# Altium schematic sheet XBeeModule.SchDoc: XBEE Radio
size A4; Revision: AA; SheetNumber: 6; SheetTotal: 6
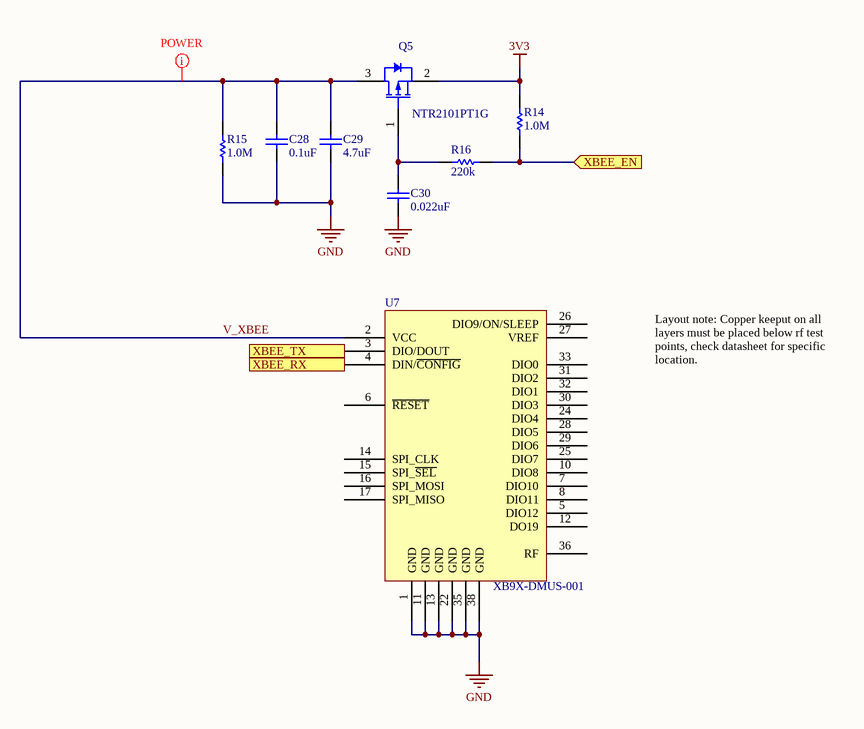
[diagram p0: XBeeModule.SchDoc]

## Parts
C28  value 0.1uF  [0402cap]  (hidden comment: C0402)
C29  value 4.7uF  [0603CAP]  (hidden comment: C0603)
C30  value 0.022uF  [0402cap]  (hidden comment: C0402)
Q5  NTR2101PT1G  [ONSC-SOT-23-3-318-08_V]
R14  value 1.0M  [0402RES]  (hidden comment: R0402)
R15  value 1.0M  [0402RES]  (hidden comment: R0402)
R16  value 220k  [0402RES]  (hidden comment: R0402)
U7  XB9X-DMUS-001  [XBee/XBee-PRO]

## Ports
XBEE_EN (in), XBEE_RX, XBEE_TX

## Nets
3V3: Q5.2(S) R14.2
GND: C28.1 C29.1 C30.1 R15.1 U7.1(GND) U7.11(GND) U7.13(GND) U7.22(GND) U7.35(GND) U7.38(GND)
V_XBEE: C28.2 C29.2 Q5.3(D) R15.2 U7.2(VCC)
XBEE_EN: R14.1 R16.2 ; port XBEE_EN
XBEE_RX: U7.4(DIN/~{CONFIG}) ; port XBEE_RX
XBEE_TX: U7.3(DIO/DOUT) ; port XBEE_TX
NetC30_2: C30.2 Q5.1(G) R16.1

Not connected (* = marked no-connect by the designer): U7 5(DIO12) 6(~{RESET}) 7(DIO10) 8(DIO11) 10(DIO8) 12(DO19) 14(SPI_CLK) 15(SPI_~{SEL}) 16(SPI_MOSI) 17(SPI_MISO) 24(DIO4) 25(DIO7) 26(DIO9/ON/SLEEP) 27(VREF) 28(DIO5) 29(DIO6) 30(DIO3) 31(DIO2) 32(DIO1) 33(DIO0) 36(RF)

## Layout directives
net class POWER: V_XBEE

## Notes on the sheet
- Layout note: Copper keeput on all layers must be placed below rf test points, check datasheet for specific location.
- Title
- Size:
- Date:
- A4
- Number:
- Time:
- Revision:
- Sheet
- of
- Grand Valley State University
- 301 W Fulton St
- Grand Rapids, MI
- 49504
- File:

## Library data of the parts
C28 = C0402: 0402 Ceramic Chip Capacitor - Standard
C29 = C0603: 0603 Ceramic Chip Capacitor - Standard
C30 = C0402: 0402 Ceramic Chip Capacitor - Standard; Manufacturer 1: Taiyo Yuden; Manufacturer Part Number 1: EMK105B7223KV-F; Supplier 1: Digi-Key; Supplier Part Number 1: 587-1224-1-ND
Q5 = NTR2101PT1G: Small Signal MOSFET, -8 V, -3.7 A, Single P-Channel, 3-Pin SOT-23, Pb-Free, Tape and Reel; Manufacturer 1: On Semiconductor; Channel Polarity: P Channel; Ciss Typ (pF): 1173; Coss Typ (pF): 289; Crss Typ (pF): 218; ID Max (A): 3.7; PD Max (W): 0.96; V(BR)DSS Min (V): 8; VGS(th) Max (V): 1; DatasheetVersion: Rev. 6; PackageVersion: Rev. AP, 11/2009; PackageReference: SOT-23-3-318-08; PackageDescription: 3-Pin Small Outline Transistor, Body 2.92 x 1.3 mm, Pitch 0.95 mm; Configuration: Single; Package Type: SOT-23-3; Packing: Tape and Reel; RoHS: Pb-Free; VGS Max (V): 8; Mounting Technology: Surface Mount; Manufacturer Part Number 1: NTR2101PT1G; ComponentLink1Description: Manufacturer URL; ComponentLink1URL: http://www.onsemi.com/; ComponentLink2Description: Datasheet; ComponentLink2URL: http://www.onsemi.cn/pub_link/Collateral/NTR2101P-D.PDF; ComponentLink3Description: Package Specification; ComponentLink3URL: http://www.onsemi.cn/pub_link/Collateral/318-08.PDF
R14-R16 = R0402: 0402 Chip Resistor - Standard; ComponentLink1URL: *